# Altium schematic sheet top.SchDoc
size A
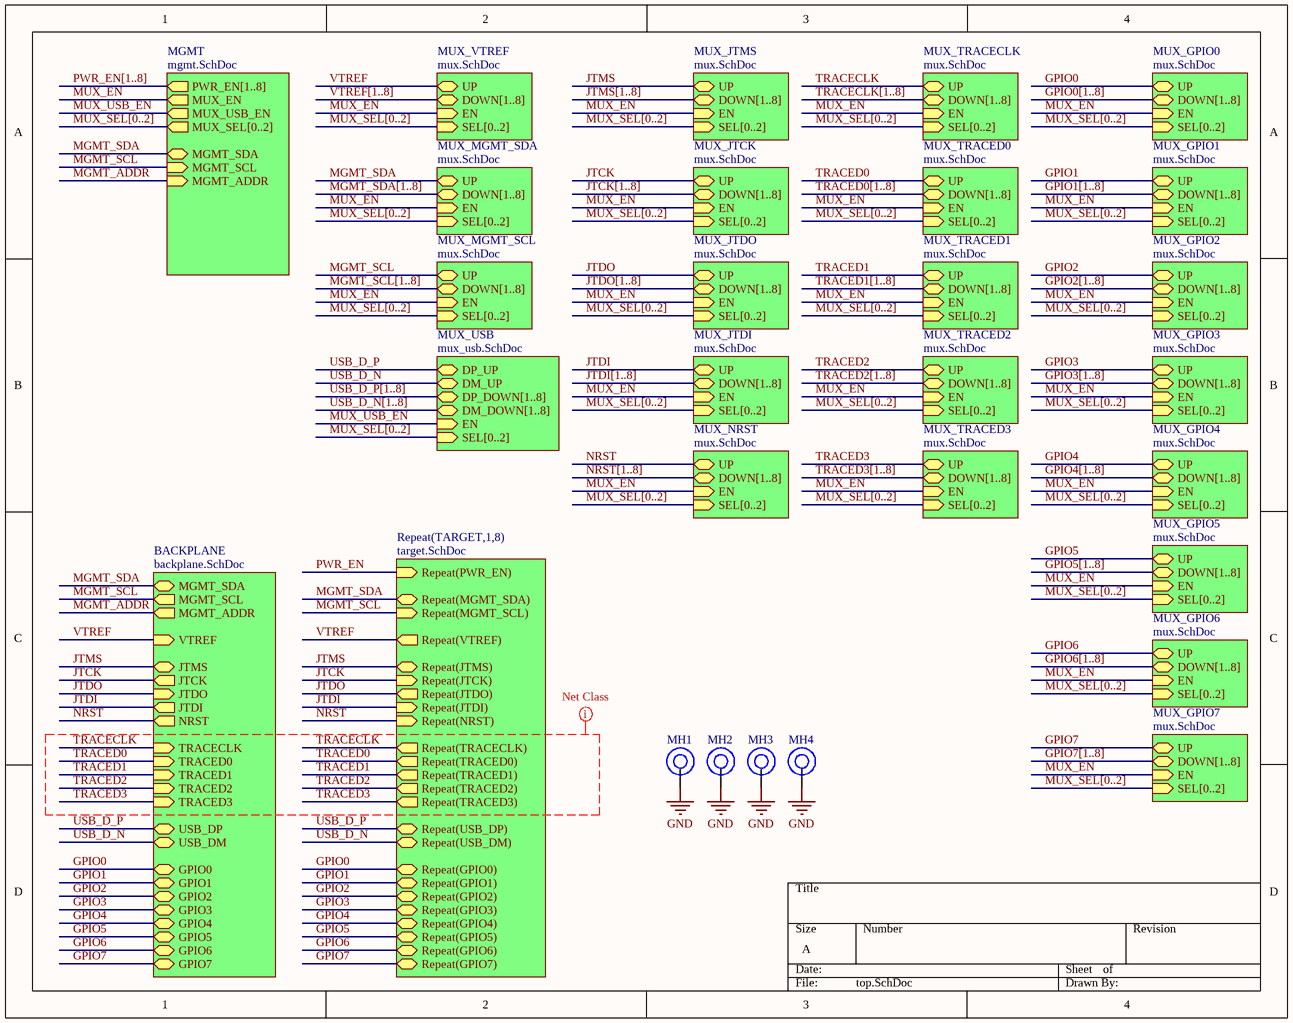
[diagram p0: top.SchDoc]

## Parts
MH1  Mounting_Hole  [WA-SMSI_M2.5]  (value not drawn)
MH2  Mounting_Hole  [WA-SMSI_M2.5]  (value not drawn)
MH3  Mounting_Hole  [WA-SMSI_M2.5]  (value not drawn)
MH4  Mounting_Hole  [WA-SMSI_M2.5]  (value not drawn)

## Sub-sheets
BACKPLANE = backplane.SchDoc: JTCK (out), GPIO1 (bidir), GPIO0 (bidir), TRACED0 (in), GPIO6 (bidir), USB_DP (bidir), NRST (out), USB_DM (bidir), MGMT_SDA (bidir), GPIO5 (bidir), JTDO (in), GPIO7 (bidir), GPIO3 (bidir), VTREF (in), TRACED2 (in), GPIO2 (bidir), TRACECLK (in), GPIO4 (bidir), MGMT_SCL (out), JTMS (bidir), TRACED3 (in), TRACED1 (in), JTDI (out), MGMT_ADDR (out)
MGMT = mgmt.SchDoc: PWR_EN[1..8] (out), MUX_SEL[0..2] (out), MGMT_SDA (bidir), MGMT_SCL (in), MUX_EN (out), MGMT_ADDR (in), MUX_USB_EN (out)
MUX_GPIO0 = mux.SchDoc: SEL[0..2] (in), DOWN[1..8] (bidir), UP (bidir), EN (in)
MUX_GPIO1 = mux.SchDoc: SEL[0..2] (in), DOWN[1..8] (bidir), UP (bidir), EN (in)
MUX_GPIO2 = mux.SchDoc: SEL[0..2] (in), DOWN[1..8] (bidir), UP (bidir), EN (in)
MUX_GPIO3 = mux.SchDoc: SEL[0..2] (in), DOWN[1..8] (bidir), UP (bidir), EN (in)
MUX_GPIO4 = mux.SchDoc: SEL[0..2] (in), DOWN[1..8] (bidir), UP (bidir), EN (in)
MUX_GPIO5 = mux.SchDoc: SEL[0..2] (in), DOWN[1..8] (bidir), UP (bidir), EN (in)
MUX_GPIO6 = mux.SchDoc: SEL[0..2] (in), DOWN[1..8] (bidir), UP (bidir), EN (in)
MUX_GPIO7 = mux.SchDoc: SEL[0..2] (in), DOWN[1..8] (bidir), UP (bidir), EN (in)
MUX_JTCK = mux.SchDoc: SEL[0..2] (in), DOWN[1..8] (bidir), UP (bidir), EN (in)
MUX_JTDI = mux.SchDoc: SEL[0..2] (in), DOWN[1..8] (bidir), UP (bidir), EN (in)
MUX_JTDO = mux.SchDoc: SEL[0..2] (in), DOWN[1..8] (bidir), UP (bidir), EN (in)
MUX_JTMS = mux.SchDoc: SEL[0..2] (in), DOWN[1..8] (bidir), UP (bidir), EN (in)
MUX_MGMT_SCL = mux.SchDoc: SEL[0..2] (in), DOWN[1..8] (bidir), UP (bidir), EN (in)
MUX_MGMT_SDA = mux.SchDoc: SEL[0..2] (in), DOWN[1..8] (bidir), UP (bidir), EN (in)
MUX_NRST = mux.SchDoc: SEL[0..2] (in), DOWN[1..8] (bidir), UP (bidir), EN (in)
MUX_TRACECLK = mux.SchDoc: SEL[0..2] (in), DOWN[1..8] (bidir), UP (bidir), EN (in)
MUX_TRACED0 = mux.SchDoc: SEL[0..2] (in), DOWN[1..8] (bidir), UP (bidir), EN (in)
MUX_TRACED1 = mux.SchDoc: SEL[0..2] (in), DOWN[1..8] (bidir), UP (bidir), EN (in)
MUX_TRACED2 = mux.SchDoc: SEL[0..2] (in), DOWN[1..8] (bidir), UP (bidir), EN (in)
MUX_TRACED3 = mux.SchDoc: SEL[0..2] (in), DOWN[1..8] (bidir), UP (bidir), EN (in)
MUX_USB = mux_usb.SchDoc: SEL[0..2] (in), DP_UP (bidir), EN (in), DP_DOWN[1..8] (bidir), DM_UP (bidir), DM_DOWN[1..8] (bidir)
MUX_VTREF = mux.SchDoc: SEL[0..2] (in), DOWN[1..8] (bidir), UP (bidir), EN (in)
Repeat(TARGET,1,8) = target.SchDoc: Repeat(JTCK) (in), Repeat(GPIO1) (bidir), Repeat(GPIO0) (bidir), Repeat(TRACED0) (out), Repeat(GPIO6) (bidir), Repeat(USB_DP) (bidir), Repeat(NRST) (in), Repeat(USB_DM) (bidir), Repeat(MGMT_SDA) (bidir), Repeat(GPIO5) (bidir), Repeat(JTDO) (out), Repeat(GPIO7) (bidir), Repeat(GPIO3) (bidir), Repeat(VTREF) (out), Repeat(TRACED2) (out), Repeat(GPIO2) (bidir), Repeat(TRACECLK) (out), Repeat(GPIO4) (bidir), Repeat(MGMT_SCL) (in), Repeat(JTMS) (bidir), Repeat(TRACED3) (out), Repeat(TRACED1) (out), Repeat(JTDI) (in), Repeat(PWR_EN) (in)

## Nets
GND: MH1.1 MH2.1 MH3.1 MH4.1
GPIO0: sheet Repeat(TARGET,1,8)/Repeat(GPIO0), sheet BACKPLANE/GPIO0, sheet MUX_GPIO0/UP
GPIO1: sheet Repeat(TARGET,1,8)/Repeat(GPIO1), sheet BACKPLANE/GPIO1, sheet MUX_GPIO1/UP
GPIO2: sheet Repeat(TARGET,1,8)/Repeat(GPIO2), sheet BACKPLANE/GPIO2, sheet MUX_GPIO2/UP
GPIO3: sheet Repeat(TARGET,1,8)/Repeat(GPIO3), sheet BACKPLANE/GPIO3, sheet MUX_GPIO3/UP
GPIO4: sheet Repeat(TARGET,1,8)/Repeat(GPIO4), sheet BACKPLANE/GPIO4, sheet MUX_GPIO4/UP
GPIO5: sheet Repeat(TARGET,1,8)/Repeat(GPIO5), sheet BACKPLANE/GPIO5, sheet MUX_GPIO5/UP
GPIO6: sheet Repeat(TARGET,1,8)/Repeat(GPIO6), sheet BACKPLANE/GPIO6, sheet MUX_GPIO6/UP
GPIO7: sheet Repeat(TARGET,1,8)/Repeat(GPIO7), sheet BACKPLANE/GPIO7, sheet MUX_GPIO7/UP
JTCK: sheet Repeat(TARGET,1,8)/Repeat(JTCK), sheet BACKPLANE/JTCK, sheet MUX_JTCK/UP
JTDI: sheet Repeat(TARGET,1,8)/Repeat(JTDI), sheet BACKPLANE/JTDI, sheet MUX_JTDI/UP
JTDO: sheet Repeat(TARGET,1,8)/Repeat(JTDO), sheet BACKPLANE/JTDO, sheet MUX_JTDO/UP
JTMS: sheet Repeat(TARGET,1,8)/Repeat(JTMS), sheet BACKPLANE/JTMS, sheet MUX_JTMS/UP
MGMT_ADDR: sheet BACKPLANE/MGMT_ADDR, sheet MGMT/MGMT_ADDR
MGMT_SCL: sheet Repeat(TARGET,1,8)/Repeat(MGMT_SCL), sheet BACKPLANE/MGMT_SCL, sheet MGMT/MGMT_SCL, sheet MUX_MGMT_SCL/UP
MGMT_SDA: sheet Repeat(TARGET,1,8)/Repeat(MGMT_SDA), sheet BACKPLANE/MGMT_SDA, sheet MGMT/MGMT_SDA, sheet MUX_MGMT_SDA/UP
MUX_EN: sheet MGMT/MUX_EN, sheet MUX_VTREF/EN, sheet MUX_JTMS/EN, sheet MUX_GPIO0/EN, sheet MUX_GPIO1/EN, sheet MUX_GPIO2/EN, sheet MUX_GPIO3/EN, sheet MUX_GPIO4/EN, sheet MUX_GPIO5/EN, sheet MUX_GPIO6/EN, sheet MUX_GPIO7/EN, sheet MUX_TRACECLK/EN, sheet MUX_TRACED0/EN, sheet MUX_TRACED1/EN, sheet MUX_TRACED2/EN, sheet MUX_TRACED3/EN, sheet MUX_JTCK/EN, sheet MUX_JTDO/EN, sheet MUX_JTDI/EN, sheet MUX_NRST/EN, sheet MUX_MGMT_SDA/EN, sheet MUX_MGMT_SCL/EN
MUX_USB_EN: sheet MGMT/MUX_USB_EN, sheet MUX_USB/EN
NRST: sheet Repeat(TARGET,1,8)/Repeat(NRST), sheet BACKPLANE/NRST, sheet MUX_NRST/UP
PWR_EN: sheet Repeat(TARGET,1,8)/Repeat(PWR_EN)
TRACECLK: sheet Repeat(TARGET,1,8)/Repeat(TRACECLK), sheet BACKPLANE/TRACECLK, sheet MUX_TRACECLK/UP
TRACED0: sheet Repeat(TARGET,1,8)/Repeat(TRACED0), sheet BACKPLANE/TRACED0, sheet MUX_TRACED0/UP
TRACED1: sheet Repeat(TARGET,1,8)/Repeat(TRACED1), sheet BACKPLANE/TRACED1, sheet MUX_TRACED1/UP
TRACED2: sheet Repeat(TARGET,1,8)/Repeat(TRACED2), sheet BACKPLANE/TRACED2, sheet MUX_TRACED2/UP
TRACED3: sheet Repeat(TARGET,1,8)/Repeat(TRACED3), sheet BACKPLANE/TRACED3, sheet MUX_TRACED3/UP
USB_D_N: sheet Repeat(TARGET,1,8)/Repeat(USB_DM), sheet BACKPLANE/USB_DM, sheet MUX_USB/DM_UP
USB_D_P: sheet Repeat(TARGET,1,8)/Repeat(USB_DP), sheet BACKPLANE/USB_DP, sheet MUX_USB/DP_UP
VTREF: sheet Repeat(TARGET,1,8)/Repeat(VTREF), sheet BACKPLANE/VTREF, sheet MUX_VTREF/UP

## Buses and harness runs
bus GPIO0[1..8] = sheet MUX_GPIO0/DOWN[1..8]
bus GPIO1[1..8] = sheet MUX_GPIO1/DOWN[1..8]
bus GPIO2[1..8] = sheet MUX_GPIO2/DOWN[1..8]
bus GPIO3[1..8] = sheet MUX_GPIO3/DOWN[1..8]
bus GPIO4[1..8] = sheet MUX_GPIO4/DOWN[1..8]
bus GPIO5[1..8] = sheet MUX_GPIO5/DOWN[1..8]
bus GPIO6[1..8] = sheet MUX_GPIO6/DOWN[1..8]
bus GPIO7[1..8] = sheet MUX_GPIO7/DOWN[1..8]
bus JTCK[1..8] = sheet MUX_JTCK/DOWN[1..8]
bus JTDI[1..8] = sheet MUX_JTDI/DOWN[1..8]
bus JTDO[1..8] = sheet MUX_JTDO/DOWN[1..8]
bus JTMS[1..8] = sheet MUX_JTMS/DOWN[1..8]
bus MGMT_SCL[1..8] = sheet MUX_MGMT_SCL/DOWN[1..8]
bus MGMT_SDA[1..8] = sheet MUX_MGMT_SDA/DOWN[1..8]
bus MUX_SEL[0..2] = sheet MGMT/MUX_SEL[0..2]
bus MUX_SEL[0..2] = sheet MUX_GPIO0/SEL[0..2]
bus MUX_SEL[0..2] = sheet MUX_GPIO1/SEL[0..2]
bus MUX_SEL[0..2] = sheet MUX_GPIO2/SEL[0..2]
bus MUX_SEL[0..2] = sheet MUX_GPIO3/SEL[0..2]
bus MUX_SEL[0..2] = sheet MUX_GPIO4/SEL[0..2]
bus MUX_SEL[0..2] = sheet MUX_GPIO5/SEL[0..2]
bus MUX_SEL[0..2] = sheet MUX_GPIO6/SEL[0..2]
bus MUX_SEL[0..2] = sheet MUX_GPIO7/SEL[0..2]
bus MUX_SEL[0..2] = sheet MUX_JTCK/SEL[0..2]
bus MUX_SEL[0..2] = sheet MUX_JTDI/SEL[0..2]
bus MUX_SEL[0..2] = sheet MUX_JTDO/SEL[0..2]
bus MUX_SEL[0..2] = sheet MUX_JTMS/SEL[0..2]
bus MUX_SEL[0..2] = sheet MUX_MGMT_SCL/SEL[0..2]
bus MUX_SEL[0..2] = sheet MUX_MGMT_SDA/SEL[0..2]
bus MUX_SEL[0..2] = sheet MUX_NRST/SEL[0..2]
bus MUX_SEL[0..2] = sheet MUX_TRACECLK/SEL[0..2]
bus MUX_SEL[0..2] = sheet MUX_TRACED0/SEL[0..2]
bus MUX_SEL[0..2] = sheet MUX_TRACED1/SEL[0..2]
bus MUX_SEL[0..2] = sheet MUX_TRACED2/SEL[0..2]
bus MUX_SEL[0..2] = sheet MUX_TRACED3/SEL[0..2]
bus MUX_SEL[0..2] = sheet MUX_USB/SEL[0..2]
bus MUX_SEL[0..2] = sheet MUX_VTREF/SEL[0..2]
bus NRST[1..8] = sheet MUX_NRST/DOWN[1..8]
bus PWR_EN[1..8] = sheet MGMT/PWR_EN[1..8]
bus TRACECLK[1..8] = sheet MUX_TRACECLK/DOWN[1..8]
bus TRACED0[1..8] = sheet MUX_TRACED0/DOWN[1..8]
bus TRACED1[1..8] = sheet MUX_TRACED1/DOWN[1..8]
bus TRACED2[1..8] = sheet MUX_TRACED2/DOWN[1..8]
bus TRACED3[1..8] = sheet MUX_TRACED3/DOWN[1..8]
bus USB_D_N[1..8] = sheet MUX_USB/DM_DOWN[1..8]
bus USB_D_P[1..8] = sheet MUX_USB/DP_DOWN[1..8]
bus VTREF[1..8] = sheet MUX_VTREF/DOWN[1..8]

## Layout directives
net class TRACE: TRACECLK, TRACED0, TRACED1, TRACED2, TRACED3